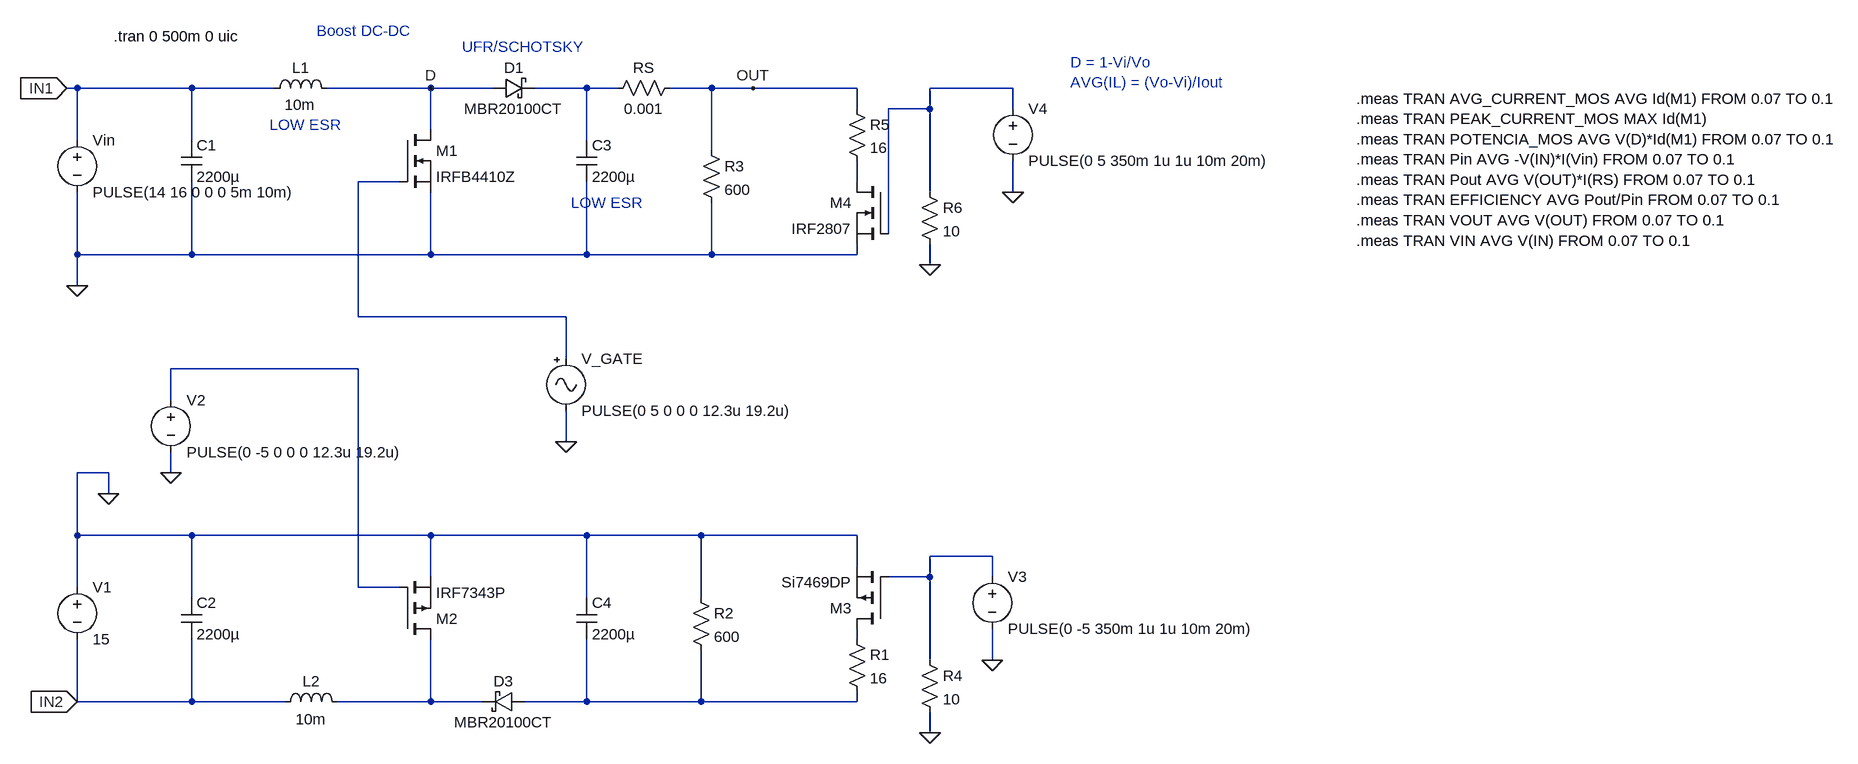
[diagram p0: schematic smps_boost_CCM_pos_neg.asc]
smps_boost_CCM_pos_neg.asc, the LTspice schematic file:
Version 4
SHEET 1 1788 680
WIRE -1024 -352 -1040 -352
WIRE -848 -352 -1024 -352
WIRE -720 -352 -848 -352
WIRE -480 -352 -640 -352
WIRE -384 -352 -480 -352
WIRE -240 -352 -320 -352
WIRE -192 -352 -240 -352
WIRE -48 -352 -112 -352
WIRE 16 -352 -48 -352
WIRE 176 -352 16 -352
WIRE 416 -352 288 -352
WIRE 176 -320 176 -352
WIRE 288 -320 288 -352
WIRE 288 -320 224 -320
WIRE 416 -320 416 -352
WIRE -480 -288 -480 -352
WIRE -1024 -272 -1024 -352
WIRE -848 -272 -848 -352
WIRE -240 -272 -240 -352
WIRE -48 -256 -48 -352
WIRE -528 -208 -592 -208
WIRE 176 -208 176 -240
WIRE 288 -192 288 -320
WIRE 416 -192 416 -240
WIRE 224 -128 224 -320
WIRE -1024 -96 -1024 -192
WIRE -848 -96 -848 -208
WIRE -848 -96 -1024 -96
WIRE -480 -96 -480 -192
WIRE -480 -96 -848 -96
WIRE -240 -96 -240 -208
WIRE -240 -96 -480 -96
WIRE -48 -96 -48 -176
WIRE -48 -96 -240 -96
WIRE 176 -96 176 -112
WIRE 176 -96 -48 -96
WIRE 288 -80 288 -112
WIRE -1024 -48 -1024 -96
WIRE -592 0 -592 -208
WIRE -272 0 -592 0
WIRE -272 64 -272 0
WIRE -592 80 -880 80
WIRE -880 128 -880 80
WIRE -272 192 -272 144
WIRE -976 240 -1024 240
WIRE -880 240 -880 208
WIRE -976 272 -976 240
WIRE -1024 336 -1024 240
WIRE -848 336 -1024 336
WIRE -480 336 -848 336
WIRE -240 336 -480 336
WIRE -64 336 -240 336
WIRE 176 336 -64 336
WIRE 384 368 288 368
WIRE 176 384 176 336
WIRE -480 400 -480 336
WIRE 288 400 288 368
WIRE 288 400 224 400
WIRE 384 400 384 368
WIRE -1024 416 -1024 336
WIRE -592 416 -592 80
WIRE -528 416 -592 416
WIRE -848 432 -848 336
WIRE -240 432 -240 336
WIRE -64 432 -64 336
WIRE 176 496 176 480
WIRE 288 528 288 400
WIRE 384 528 384 480
WIRE -1024 592 -1024 496
WIRE -848 592 -848 496
WIRE -848 592 -1024 592
WIRE -704 592 -848 592
WIRE -480 592 -480 496
WIRE -480 592 -624 592
WIRE -400 592 -480 592
WIRE -240 592 -240 496
WIRE -240 592 -336 592
WIRE -64 592 -64 512
WIRE -64 592 -240 592
WIRE 176 592 176 576
WIRE 176 592 -64 592
WIRE 288 640 288 608
FLAG -1024 -48 0
FLAG -272 192 0
FLAG -480 -352 D
FLAG -1040 -352 IN1
IOPIN -1040 -352 In
FLAG -976 272 0
FLAG -880 240 0
FLAG -1024 592 IN2
IOPIN -1024 592 In
FLAG 384 528 0
FLAG 16 -352 OUT
FLAG 288 640 0
FLAG 416 -192 0
FLAG 288 -80 0
SYMBOL cap -864 -272 R0
SYMATTR InstName C1
SYMATTR Value 2200µ
SYMBOL ind -736 -336 R270
WINDOW 0 32 56 VTop 2
WINDOW 3 -25 55 VTop 2
SYMATTR InstName L1
SYMATTR Value 10m
SYMATTR SpiceLine Rser=0.001
SYMBOL schottky -384 -336 R270
WINDOW 0 32 32 VTop 2
WINDOW 3 0 32 VBottom 2
SYMATTR InstName D1
SYMATTR Value MBR20100CT
SYMBOL cap -256 -272 R0
SYMATTR InstName C3
SYMATTR Value 2200µ
SYMATTR SpiceLine Rser=0.002
SYMBOL nmos -528 -288 R0
SYMATTR InstName M1
SYMATTR Value IRFB4410Z
SYMBOL Misc\\signal -272 48 R0
WINDOW 123 0 0 Left 2
WINDOW 39 0 0 Left 2
SYMATTR InstName V_GATE
SYMATTR Value PULSE(0 5 0 0 0 12.3u 19.2u)
SYMBOL voltage -1024 -288 R0
WINDOW 123 0 0 Left 2
WINDOW 39 0 0 Left 2
SYMATTR InstName Vin
SYMATTR Value PULSE(14 16 0 0 0 5m 10m)
SYMBOL res -96 -368 R90
WINDOW 0 0 56 VBottom 2
WINDOW 3 32 56 VTop 2
SYMATTR InstName RS
SYMATTR Value 0.001
SYMBOL res 160 480 R0
SYMATTR InstName R1
SYMATTR Value 16
SYMBOL voltage -1024 400 R0
SYMATTR InstName V1
SYMATTR Value 15
SYMBOL cap -864 432 R0
SYMATTR InstName C2
SYMATTR Value 2200µ
SYMBOL ind -720 608 R270
WINDOW 0 32 56 VTop 2
WINDOW 3 5 56 VBottom 2
SYMATTR InstName L2
SYMATTR Value 10m
SYMATTR SpiceLine Rser=0.001
SYMBOL cap -256 432 R0
SYMATTR InstName C4
SYMATTR Value 2200µ
SYMATTR SpiceLine Rser=0.002
SYMBOL res -80 416 R0
SYMATTR InstName R2
SYMATTR Value 600
SYMBOL pmos -528 496 M180
SYMATTR InstName M2
SYMATTR Value IRF7343P
SYMBOL schottky -336 576 R90
WINDOW 0 0 32 VBottom 2
WINDOW 3 32 32 VTop 2
SYMATTR InstName D3
SYMATTR Value MBR20100CT
SYMBOL voltage -880 112 R0
WINDOW 123 0 0 Left 2
WINDOW 39 0 0 Left 2
SYMATTR InstName V2
SYMATTR Value PULSE(0 -5 0 0 0 12.3u 19.2u)
SYMBOL voltage 384 384 R0
WINDOW 123 0 0 Left 2
WINDOW 39 0 0 Left 2
SYMATTR InstName V3
SYMATTR Value PULSE(0 -5 350m 1u 1u 10m 20m)
SYMBOL res -64 -272 R0
SYMATTR InstName R3
SYMATTR Value 600
SYMBOL res 272 512 R0
SYMATTR InstName R4
SYMATTR Value 10
SYMBOL pmos 224 480 R180
SYMATTR InstName M3
SYMATTR Value Si7469DP
SYMBOL res 160 -336 R0
SYMATTR InstName R5
SYMATTR Value 16
SYMBOL voltage 416 -336 R0
WINDOW 123 0 0 Left 2
WINDOW 39 0 0 Left 2
SYMATTR InstName V4
SYMATTR Value PULSE(0 5 350m 1u 1u 10m 20m)
SYMBOL res 272 -208 R0
SYMATTR InstName R6
SYMATTR Value 10
SYMBOL nmos 224 -208 M0
SYMATTR InstName M4
SYMATTR Value IRF2807
TEXT -968 -432 Left 2 !.tran 0 500m 0 uic
TEXT 944 -336 Left 2 !.meas TRAN AVG_CURRENT_MOS AVG Id(M1) FROM 0.07 TO 0.1\n.meas TRAN PEAK_CURRENT_MOS MAX Id(M1)\n.meas TRAN POTENCIA_MOS AVG V(D)*Id(M1) FROM 0.07 TO 0.1\n.meas TRAN Pin AVG -V(IN)*I(Vin) FROM 0.07 TO 0.1\n.meas TRAN Pout AVG V(OUT)*I(RS) FROM 0.07 TO 0.1\n.meas TRAN EFFICIENCY AVG Pout/Pin FROM 0.07 TO 0.1\n.meas TRAN VOUT AVG V(OUT) FROM 0.07 TO 0.1\n.meas TRAN VIN AVG V(IN) FROM 0.07 TO 0.1
TEXT -656 -440 Left 2 ;Boost DC-DC
TEXT 504 -392 Left 2 ;D = 1-Vi/Vo\nAVG(IL) = (Vo-Vi)/Iout
TEXT -264 -176 Left 2 ;LOW ESR
TEXT -432 -416 Left 2 ;UFR/SCHOTSKY
TEXT -728 -296 Left 2 ;LOW ESR

The netlist it stands for:
* smps_boost_CCM_pos_neg.asc
C1 IN1 0 2200µ
L1 IN1 D 10m Rser=0.001
D1 D N001 MBR20100CT
C3 N001 0 2200µ Rser=0.002
M1 D N003 0 0 IRFB4410Z
V_GATE N003 0 PULSE(0 5 0 0 0 12.3u 19.2u)
Vin IN1 0 PULSE(14 16 0 0 0 5m 10m)
RS OUT N001 0.001
R1 N007 N009 16
V1 0 IN2 15
C2 0 IN2 2200µ
L2 IN2 N008 10m Rser=0.001
C4 0 N009 2200µ Rser=0.002
R2 0 N009 600
M2 N008 N005 0 0 IRF7343P
D3 N009 N008 MBR20100CT
V2 N005 0 PULSE(0 -5 0 0 0 12.3u 19.2u)
V3 N006 0 PULSE(0 -5 350m 1u 1u 10m 20m)
R3 OUT 0 600
R4 N006 0 10
M3 N007 N006 0 0 Si7469DP
R5 OUT N004 16
V4 N002 0 PULSE(0 5 350m 1u 1u 10m 20m)
R6 N002 0 10
M4 N004 N002 0 0 IRF2807
.model D D
.lib standard.dio
.model NMOS NMOS
.model PMOS PMOS
.lib standard.mos
.tran 0 500m 0 uic
.meas TRAN AVG_CURRENT_MOS AVG Id(M1) FROM 0.07 TO 0.1
.meas TRAN PEAK_CURRENT_MOS MAX Id(M1)
.meas TRAN POTENCIA_MOS AVG V(D)*Id(M1) FROM 0.07 TO 0.1
.meas TRAN Pin AVG -V(IN)*I(Vin) FROM 0.07 TO 0.1
.meas TRAN Pout AVG V(OUT)*I(RS) FROM 0.07 TO 0.1
.meas TRAN EFFICIENCY AVG Pout/Pin FROM 0.07 TO 0.1
.meas TRAN VOUT AVG V(OUT) FROM 0.07 TO 0.1
.meas TRAN VIN AVG V(IN) FROM 0.07 TO 0.1
* Boost DC-DC
* D = 1-Vi/Vo
* AVG(IL) = (Vo-Vi)/Iout
* LOW ESR
* UFR/SCHOTSKY
* LOW ESR
.backanno
.end